# EAGLE design Wiegand_RS485 (EAGLE 7.1.0)
Assembly variants: minimal
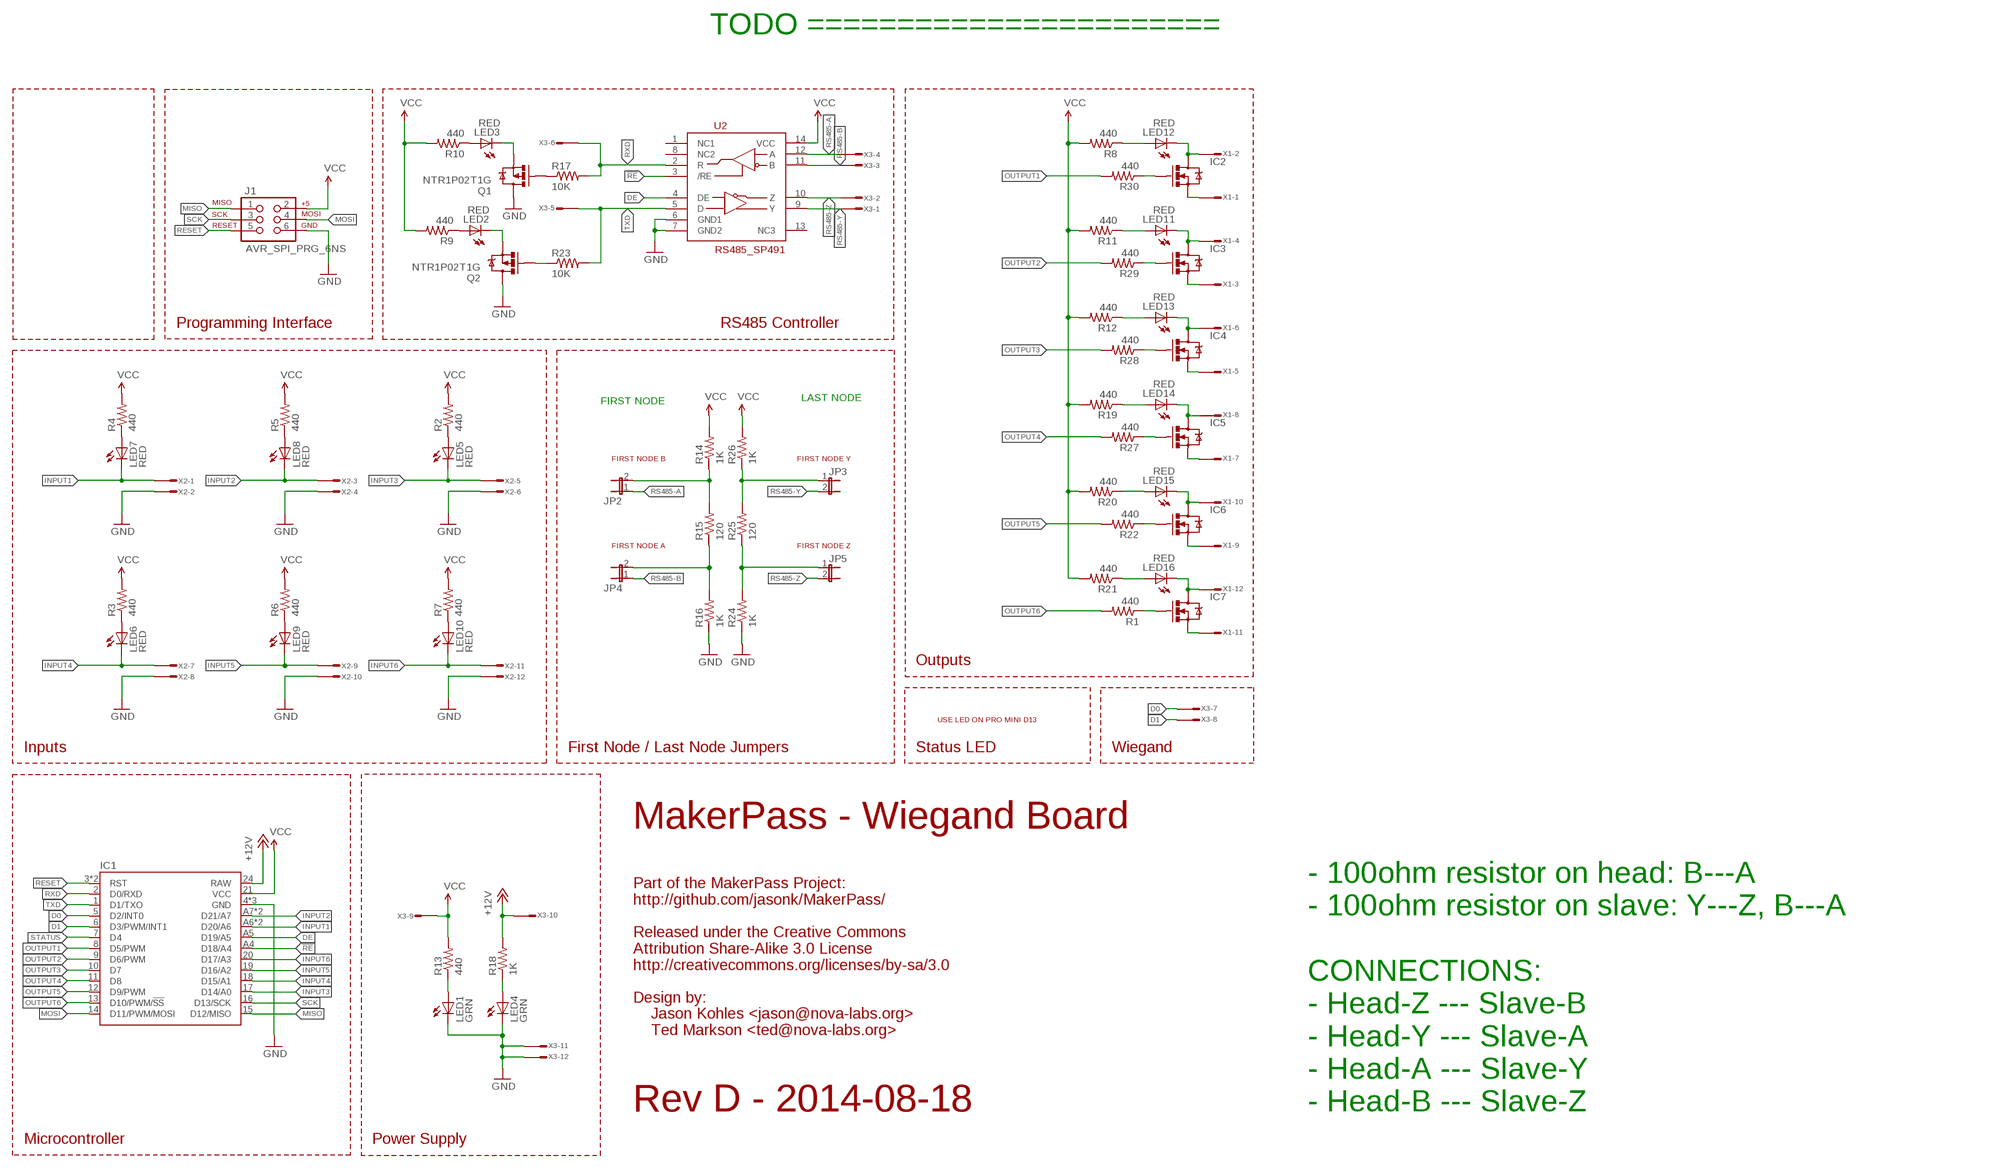
[diagram p0: schematic, sheet 1]

## Parts
IC1  ARDUINO-PRO-MINI-ALIEXPRESS  [ARDUINO-PRO-MINI-ALIEXPRESS]
IC2  MOSFET-NCHANNEL-SOT23  [SOT23]
IC3  MOSFET-NCHANNEL-SOT23  [SOT23]
IC4  MOSFET-NCHANNEL-SOT23  [SOT23]
IC5  MOSFET-NCHANNEL-SOT23  [SOT23]
IC6  MOSFET-NCHANNEL-SOT23  [SOT23]
IC7  MOSFET-NCHANNEL-SOT23  [SOT23]
J1  AVR_SPI_PRG_6NS  [2X3-NS]  (not fitted in variant minimal)
JP2  JUMPER-2PTH  [1X02]
JP3  JUMPER-2PTH  [1X02]
JP4  JUMPER-2PTH  [1X02]
JP5  JUMPER-2PTH  [1X02]
LED1  GRN  LED-0805  [LED-805]  (not fitted in variant minimal)
LED2  RED  LED-0805  [LED-805]  (not fitted in variant minimal)
LED3  RED  LED-0805  [LED-805]  (not fitted in variant minimal)
LED4  GRN  LED-0805  [LED-805]  (not fitted in variant minimal)
LED5  RED  LED-0805  [LED-805]  (not fitted in variant minimal)
LED6  RED  LED-0805  [LED-805]  (not fitted in variant minimal)
LED7  RED  LED-0805  [LED-805]  (not fitted in variant minimal)
LED8  RED  LED-0805  [LED-805]  (not fitted in variant minimal)
LED9  RED  LED-0805  [LED-805]  (not fitted in variant minimal)
LED10  RED  LED-0805  [LED-805]  (not fitted in variant minimal)
LED11  RED  LED-0805  [LED-805]  (not fitted in variant minimal)
LED12  RED  LED-0805  [LED-805]  (not fitted in variant minimal)
LED13  RED  LED-0805  [LED-805]  (not fitted in variant minimal)
LED14  RED  LED-0805  [LED-805]  (not fitted in variant minimal)
LED15  RED  LED-0805  [LED-805]  (not fitted in variant minimal)
LED16  RED  LED-0805  [LED-805]  (not fitted in variant minimal)
Q1  NTR1P02T1G  MOSFET-PCHANNELSMD  [SOT23-3]  (not fitted in variant minimal)
Q2  NTR1P02T1G  MOSFET-PCHANNELSMD  [SOT23-3]  (not fitted in variant minimal)
R1  440  RESISTOR0603-RES  [0603-RES]  (not fitted in variant minimal)
R2  440  RESISTOR0603-RES  [0603-RES]  (not fitted in variant minimal)
R3  440  RESISTOR0603-RES  [0603-RES]  (not fitted in variant minimal)
R4  440  RESISTOR0603-RES  [0603-RES]  (not fitted in variant minimal)
R5  440  RESISTOR0603-RES  [0603-RES]  (not fitted in variant minimal)
R6  440  RESISTOR0603-RES  [0603-RES]  (not fitted in variant minimal)
R7  440  RESISTOR0603-RES  [0603-RES]  (not fitted in variant minimal)
R8  440  RESISTOR0603-RES  [0603-RES]  (not fitted in variant minimal)
R9  440  RESISTOR0603-RES  [0603-RES]  (not fitted in variant minimal)
R10  440  RESISTOR0603-RES  [0603-RES]  (not fitted in variant minimal)
R11  440  RESISTOR0603-RES  [0603-RES]  (not fitted in variant minimal)
R12  440  RESISTOR0603-RES  [0603-RES]  (not fitted in variant minimal)
R13  440  RESISTOR0603-RES  [0603-RES]  (not fitted in variant minimal)
R14  1K  RESISTOR0603-RES  [0603-RES]
R15  120  RESISTOR0603-RES  [0603-RES]
R16  1K  RESISTOR0603-RES  [0603-RES]  (not fitted in variant minimal)
R17  10K  RESISTOR0603-RES  [0603-RES]
R18  1K  RESISTOR0603-RES  [0603-RES]  (not fitted in variant minimal)
R19  440  RESISTOR0603-RES  [0603-RES]
R20  440  RESISTOR0603-RES  [0603-RES]
R21  440  RESISTOR0603-RES  [0603-RES]
R22  440  RESISTOR0603-RES  [0603-RES]
R23  10K  RESISTOR0603-RES  [0603-RES]
R24  1K  RESISTOR0603-RES  [0603-RES]  (not fitted in variant minimal)
R25  120  RESISTOR0603-RES  [0603-RES]
R26  1K  RESISTOR0603-RES  [0603-RES]  (not fitted in variant minimal)
R27  440  RESISTOR0603-RES  [0603-RES]
R28  440  RESISTOR0603-RES  [0603-RES]
R29  440  RESISTOR0603-RES  [0603-RES]
R30  440  RESISTOR0603-RES  [0603-RES]
U2  RS485_SP491  [SOIC-14]
X1  CON-1X12-TERMBLOCK-3.5MM  [CON-1X12-TERMBLOCK-3.5MM]
X2  CON-1X12-TERMBLOCK-3.5MM  [CON-1X12-TERMBLOCK-3.5MM]
X3  CON-1X12-TERMBLOCK-3.5MM  [CON-1X12-TERMBLOCK-3.5MM]

## Nets
!RE!: IC1.A4(D18/A4) U2.3(/RE)
+12V [power]: IC1.24(RAW) R18.2 X3.10
D0: IC1.5(D2/INT0) X3.7
D1: IC1.6(D3/PWM/INT1) X3.8
DE: IC1.A5(D19/A5) U2.4(DE)
GND: IC1.4(GND) IC1.23(GND) IC1.25(GND) J1.6 LED1.C LED4.C Q1.3(D) Q2.3(D) R16.1 R24.1 U2.6(GND1) U2.7(GND2) X2.2 X2.4 X2.6 X2.8 X2.10 X2.12 X3.11 X3.12
INPUT1: IC1.A6(D20/A6) IC1.A6@2(D20/A6) LED7.C X2.1
INPUT2: IC1.A7(D21/A7) IC1.A7@2(D21/A7) LED8.C X2.3
INPUT3: IC1.17(D14/A0) LED5.C X2.5
INPUT4: IC1.18(D15/A1) LED6.C X2.7
INPUT5: IC1.19(D16/A2) LED9.C X2.9
INPUT6: IC1.20(D17/A3) LED10.C X2.11
MISO: IC1.15(D12/MISO) J1.1
MOSI: IC1.14(D11/PWM/MOSI) J1.4
N$1: LED1.A R13.1
N$3: IC6.2(S) X1.9
N$4: IC6.3(D) LED15.C X1.10
N$5: LED5.A R2.1
N$6: JP5.1 R24.2 R25.1
N$7: JP3.1 R25.2 R26.1
N$8: LED4.A R18.1
N$9: LED3.C Q1.2(S)
N$10: LED6.A R3.1
N$11: LED7.A R4.1
N$12: LED8.A R5.1
N$13: LED9.A R6.1
N$14: LED10.A R7.1
N$16: LED12.A R8.1
N$17: IC2.2(S) X1.1
N$18: IC2.3(D) LED12.C X1.2
N$19: IC3.2(S) X1.3
N$20: IC4.3(D) LED13.C X1.6
N$21: LED11.A R11.1
N$23: IC4.2(S) X1.5
N$25: LED13.A R12.1
N$26: LED2.A R9.1
N$27: LED3.A R10.1
N$29: IC5.2(S) X1.7
N$30: IC5.3(D) LED14.C X1.8
N$31: LED14.A R19.1
N$33: LED2.C Q2.2(S)
N$34: Q1.1(G) R17.1
N$35: LED15.A R20.1
N$37: IC7.2(S) X1.11
N$38: IC7.3(D) LED16.C X1.12
N$39: LED16.A R21.1
N$41: IC7.1(G) R1.1
N$42: Q2.1(G) R23.1
N$43: JP2.2 R14.1 R15.2
N$44: JP4.2 R15.1 R16.2
N$48: IC2.1(G) R30.1
N$49: IC3.1(G) R29.1
N$50: IC4.1(G) R28.1
N$51: IC5.1(G) R27.1
N$52: IC6.1(G) R22.1
N$53: IC3.3(D) LED11.C X1.4
OUTPUT1: IC1.8(D5/PWM) R30.2
OUTPUT2: IC1.9(D6/PWM) R29.2
OUTPUT3: IC1.10(D7) R28.2
OUTPUT4: IC1.11(D8) R27.2
OUTPUT5: IC1.12(D9/PWM) R22.2
OUTPUT6: IC1.13(D10/PWM/!SS) R1.2
RESET: IC1.3(RST) IC1.22(RST) J1.5
RS485-A: JP2.1 U2.12(A) X3.4
RS485-B: JP4.1 U2.11(B) X3.3
RS485-Y: JP3.2 U2.9(Y) X3.1
RS485-Z: JP5.2 U2.10(Z) X3.2
RXD: IC1.2(D0/RXD) R17.2 U2.2(R) X3.6
SCK: IC1.16(D13/SCK) J1.3
STATUS: IC1.7(D4)
TXD: IC1.1(D1/TXO) R23.2 U2.5(D) X3.5
VCC: IC1.21(VCC) J1.2 R2.2 R3.2 R4.2 R5.2 R6.2 R7.2 R8.2 R9.2 R10.2 R11.2 R12.2 R13.2 R14.2 R19.2 R20.2 R21.2 R26.2 U2.14(VCC) X3.9
Unconnected: U2.1(NC1) U2.8(NC2) U2.13(NC3)

## Notes on the sheet
- TODO =======================
- Programming Interface | RS485 Controller
- LAST NODE
- FIRST NODE
- FIRST NODE B | FIRST NODE Y
- FIRST NODE A | FIRST NODE Z
- Outputs
- USE LED ON PRO MINI D13
- Inputs | First Node / Last Node Jumpers | Status LED | Wiegand
- MakerPass - Wiegand Board
- Part of the MakerPass Project:
  http://github.com/jasonk/MakerPass/
  
  Released under the Creative Commons
  Attribution Share-Alike 3.0 License
  http://creativecommons.org/licenses/by-sa/3.0
  
  Design by:
      Jason Kohles <jason@nova-labs.org>
      Ted Markson <ted@nova-labs.org>
- Rev D - 2014-08-18
- - 100ohm resistor on head: B---A
  - 100ohm resistor on slave: Y---Z, B---A
  
  CONNECTIONS:
  - Head-Z --- Slave-B
  - Head-Y --- Slave-A
  - Head-A --- Slave-Y
  - Head-B --- Slave-Z
- Microcontroller | Power Supply

## Library data of the parts
IC1 = LumisenseV6:ARDUINO-PRO-MINI: ARDUINO_PRO_MINI
IC2-IC7 = LumisenseV6:MOSFET-NCHANNEL: MOSFET-NCHANNEL; MFG: DIODES INC; MFG_PN: DMN6140L-7; SUPP: DIGIKEY; SUPP_PN: DMN6140L-7DICT-ND
J1 = SparkFun-Connectors:AVR_SPI_PRG_6: AVR ISP 6 Pin This is the reduced ISP connector for AVR programming. Common on Arduino. This footprint will take up less PCB space and can be used with a 10-pin to 6-pin adapter such as SKU: BOB-08508
JP2-JP5 = SparkFun:JUMPER-2: Jumper Basic 0.1" spaced jumper. Use with breakaway headers.; MFG_PN: 1x2 pin header
LED1 LED4 = dp_devices:LED: Light Emitting Diode; MFG_PN: LG R971-KN-1
LED2 LED3 LED5-LED16 = dp_devices:LED: Light Emitting Diode; MFG_PN: LY R976-PS-36
Q1 Q2 = SparkFun:MOSFET-PCHANNEL; MFG_PN: NTR1P02T1G
R1-R13 R17 R19-R23 R27-R30 = SparkFun:RESISTOR: Resistor Basic schematic elements and footprints for 0603, 1206, and PTH resistors.; MFG_PN: ERJ3EKF3300V
R14 R16 R18 R24 R26 = SparkFun:RESISTOR: Resistor Basic schematic elements and footprints for 0603, 1206, and PTH resistors.; MFG_PN: ERJ-3EKF1001V
R15 R25 = SparkFun:RESISTOR: Resistor Basic schematic elements and footprints for 0603, 1206, and PTH resistors.; MFG_PN: ERJ-3EKF1200V
U2 = SparkFun:RS485_SP491; MFG_PN: SP491EEN-L
X1-X3 = LumisenseV6:CON-1X12: CON-1X12

## Board
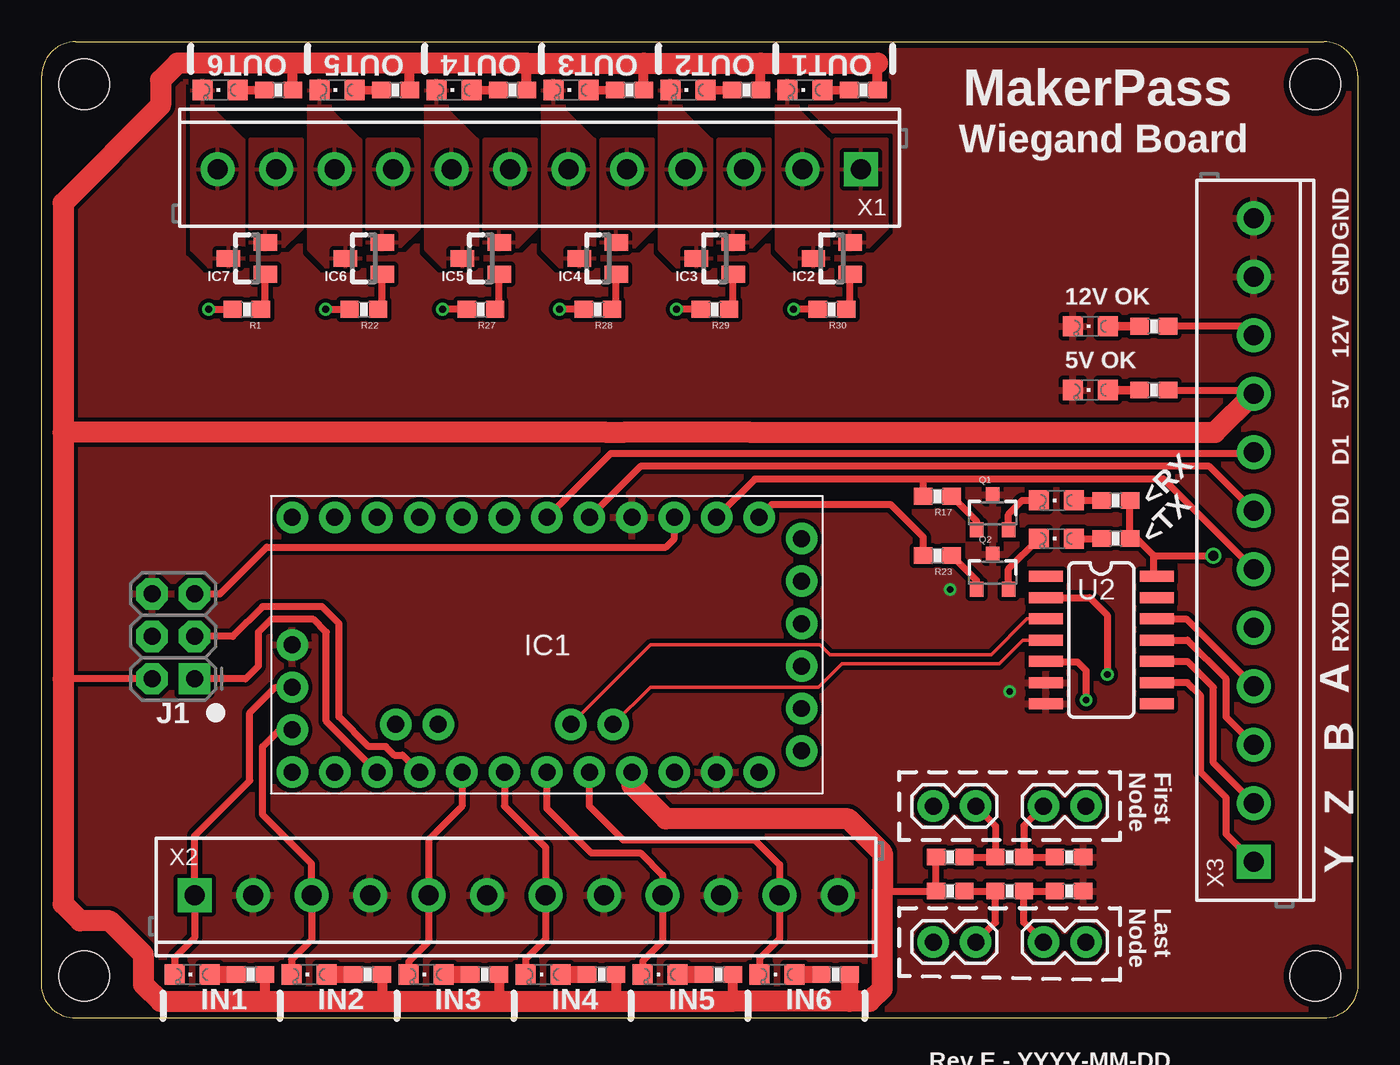
[diagram p1: board, top side]
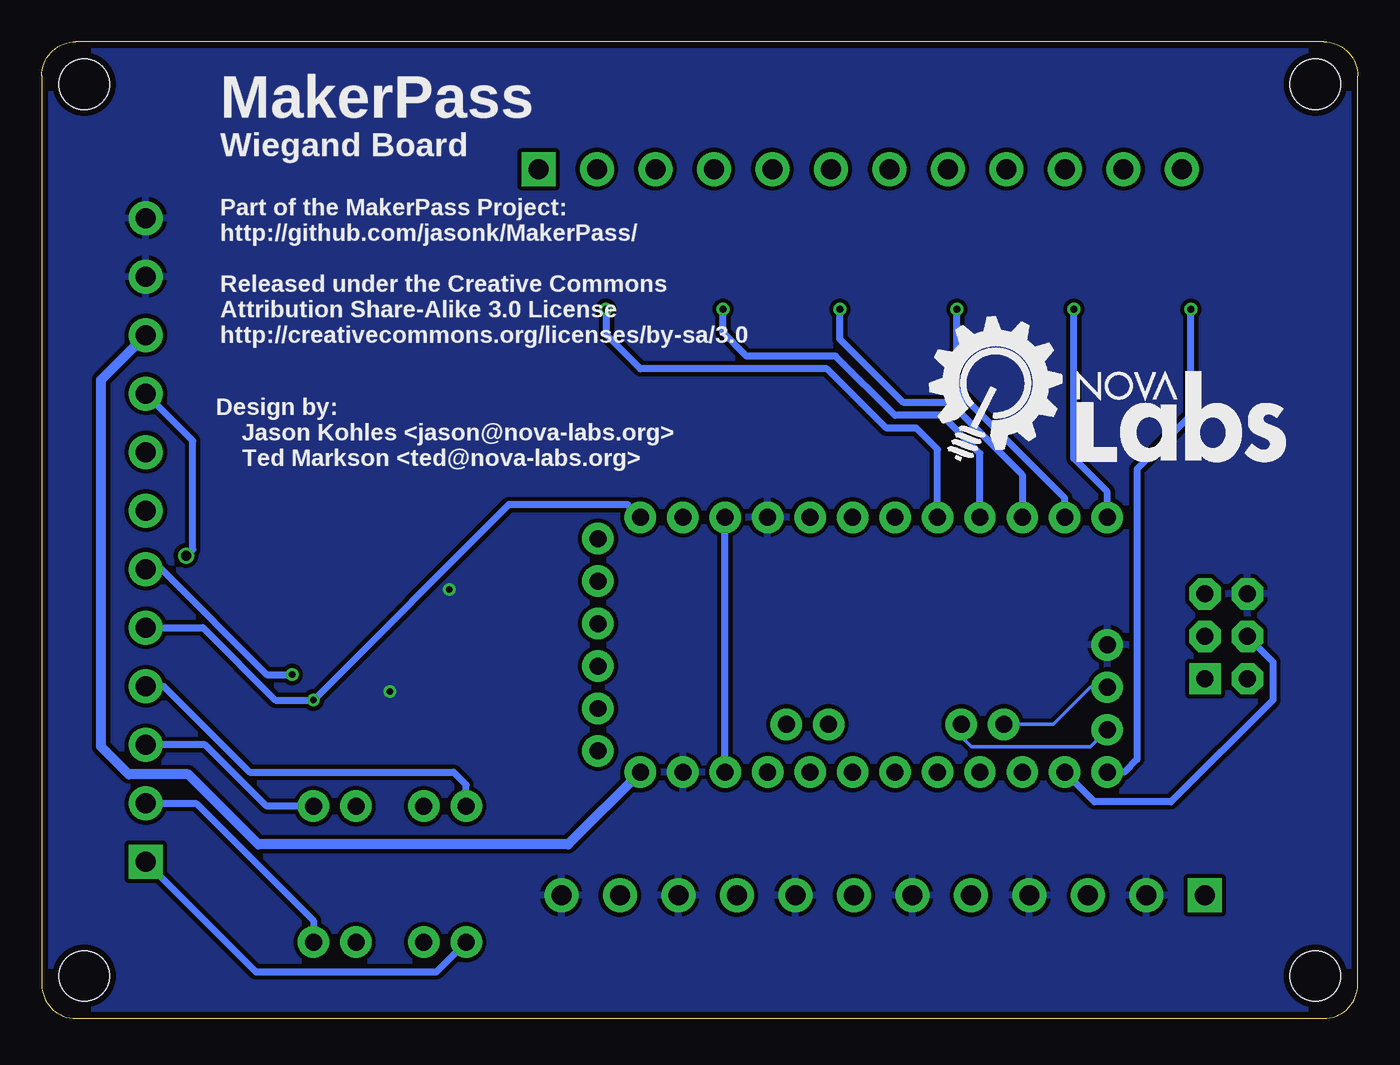
[diagram p2: board, bottom side, seen from below]

Size 78.74 x 58.42 mm. Coordinates in mm from the lower left corner, seen from the top.
Outline: 0,2.03 0,56.39 arc-90 2.03,58.42 76.71,58.42 arc-90 78.74,56.39 78.74,2.03 arc-90 76.71,0 2.03,0 arc-90 0,2.03
Copper layers (1*16): Top 0.0356mm / dielectric 1.5011mm / Bottom 0.0356mm
Design rules "OSHPark": minimum track width 6mil, minimum drill 13mil, track to track 6mil, track to pad 6mil, pad to pad 6mil, via to via 6mil, smd to smd 6mil, copper to edge 15mil, drill to drill 6mil, minimum pad ring 7mil, minimum via ring 7mil, stop-mask expansion 3mil, vias tented up to drill 0mil, thermal gap 10mil
Holes 3 mm at 2.54,2.54 76.2,2.54 2.54,55.88 76.2,55.88
tKeepout: area -0.5,-0.5 to 5.5,5.5; area 73.2,-0.5 to 79.2,5.5; area -0.5,52.9 to 5.5,58.9; area 73.2,52.9 to 79.2,58.9
bKeepout: area -0.5,-0.5 to 5.5,5.5; area 73.2,-0.5 to 79.2,5.5; area -0.5,52.9 to 5.5,58.9; area 73.2,52.9 to 79.2,58.9

### Footprints (pad centres in the part's own frame; a part is rotated, then mirrored left to right if it is on the bottom)
ARDUINO-PRO-MINI-ALIEXPRESS = drill 1.016 pad 1.88: 1 -7.62,12.7; 2 -7.62,10.16; 3 -7.62,7.62; 4 -7.62,5.08; 5 -7.62,2.54; 6 -7.62,0; 7 -7.62,-2.54; 8 -7.62,-5.08; 9 -7.62,-7.62; 10 -7.62,-10.16; 11 -7.62,-12.7; 12 -7.62,-15.24; 13 7.62,-15.24; 14 7.62,-12.7; 15 7.62,-10.16; 16 7.62,-7.62; 17 7.62,-5.08; 18 7.62,-2.54; 19 7.62,0; 20 7.62,2.54; 21 7.62,5.08; 22 7.62,7.62; 23 7.62,10.16; 24 7.62,12.7; 25 0,-15.24; A4 4.763,1.429; A5 4.763,3.969; A6 2.54,-15.24; A6@2 4.763,-9.049; A7 5.08,-15.24; A7@2 4.763,-6.509; BLK -6.35,15.24; GND -3.81,15.24; GRN 6.35,15.24; RXI 1.27,15.24; TXO 3.81,15.24; VCC -1.27,15.24
SOT23 = smd 1 x 1.4: 1 -0.95,-1.1; 2 0.95,-1.1; 3 0,1.1
2X3-NS = drill 1.016 pad 1.88 square: 1 -2.54,-1.27 | drill 1.016 pad 1.88 octagon: 2 -2.54,1.27; 3 0,-1.27; 4 0,1.27; 5 2.54,-1.27; 6 2.54,1.27
1X02 = drill 1.016 pad 1.88: 1 0,0; 2 2.54,0
LED-805 = smd 1.2 x 1.2: A 0,-1.05; C 0,1.05
SOT23-3 = smd 0.8 x 0.9: 1 -0.95,-1; 2 0.95,-1; 3 0,1.1
0603-RES = smd 1.1 x 1: 1 -0.85,0; 2 0.85,0
SOIC-14 = smd 0.66 x 2.032: 1 -4.445,-3.315; 2 -3.175,-3.315; 3 -1.905,-3.315; 4 -0.635,-3.315; 5 0.635,-3.315; 6 1.905,-3.315; 7 3.175,-3.315; 8 3.175,3.315; 9 1.905,3.315; 10 0.635,3.315; 11 -0.635,3.315; 12 -1.905,3.315; 13 -3.175,3.315; 14 -4.445,3.315
CON-1X12-TERMBLOCK-3.5MM = drill 1.2 pad 2.032 square: 1 0,0 | drill 1.2 pad 2.032: 2 3.5,0; 3 7,0; 4 10.5,0; 5 14,0; 6 17.5,0; 7 21,0; 8 24.5,0; 9 28,0; 10 31.5,0; 11 35,0; 12 38.5,0

### Placement (x,y rotation side)
IC1  30.23,22.35 270 top
IC2  47.27,45.47 90 top
IC3  40.27,45.47 90 top
IC4  33.27,45.47 90 top
IC5  26.27,45.47 90 top
IC6  19.27,45.47 90 top
IC7  12.27,45.47 90 top
J1  7.87,22.86 90 top
JP2  53.34,12.7 0 top
JP3  55.88,4.57 180 top
JP4  62.48,12.7 180 top
JP5  59.94,4.57 0 top
LED1  62.74,37.59 90 top
LED2  60.71,28.7 90 top
LED3  60.71,30.99 90 top
LED4  62.74,41.4 90 top
LED5  23,2.63 90 top
LED6  30,2.63 90 top
LED7  9,2.63 90 top
LED8  16,2.63 90 top
LED9  37,2.63 90 top
LED10  44,2.63 90 top
LED11  38.67,55.54 90 top
LED12  45.67,55.54 90 top
LED13  31.67,55.54 90 top
LED14  24.67,55.54 90 top
LED15  17.67,55.54 90 top
LED16  10.67,55.54 90 top
Q1  56.9,30.23 0 top
Q2  56.9,26.67 0 top
R1  12.27,42.42 180 top
R2  26.5,2.63 0 top
R3  33.5,2.63 0 top
R4  12.5,2.63 0 top
R5  19.5,2.63 0 top
R6  40.5,2.63 0 top
R7  47.5,2.63 0 top
R8  49.17,55.54 0 top
R9  64.26,28.7 0 top
R10  64.26,30.99 0 top
R11  42.17,55.54 0 top
R12  35.17,55.54 0 top
R13  66.55,37.59 0 top
R14  54.36,9.65 180 top
R15  57.91,9.65 180 top
R16  61.47,9.65 180 top
R17  53.59,31.24 180 top
R18  66.55,41.4 0 top
R19  28.17,55.54 0 top
R20  21.17,55.54 0 top
R21  14.17,55.54 0 top
R22  19.27,42.42 180 top
R23  53.59,27.69 180 top
R24  61.47,7.62 180 top
R25  57.91,7.62 180 top
R26  54.36,7.62 180 top
R27  26.27,42.42 180 top
R28  33.27,42.42 180 top
R29  40.27,42.42 180 top
R30  47.27,42.42 180 top
U2  63.4,22 270 top
U$1  [NOVA-LABS-LOGO-FULL-SMALL]  25.65,33.27 0 bottom
X1  49.02,50.8 180 top
X2  9.14,7.37 0 top
X3  72.51,9.37 90 top

### Tracks (layer width: path | path; a pad name or v marks a point on that pad's centre or on a via)
!RE!
  Top 0.203: U2.3 58.96,23.91 56.82,21.76 47.16,21.76 46.58,22.35 36.42,22.35 IC1.A4
+12V
  Top 0.406: X3.10 71.98,41.4 R18.2
  Bottom 0.61: IC1.24 47.24,10.41 65.79,10.41 69.98,14.61 73.53,14.61 75.18,16.26 75.18,38.2 X3.10
D0
  Top 0.406: X3.7 69.87,33.02 35.81,33.02 IC1.5
D1
  Top 0.406: X3.8 72.42,33.78 34.04,33.78 IC1.6
DE
  Top 0.203: U2.4 58.7,22.64 57.29,21.22 47.89,21.22 46.48,19.81 36.42,19.81 IC1.A5
GND  (via drill 0.41)
  other vias: 57.91,19.56 54.36,25.65
  pour Top (isolate 0.254, rank 6): 0,0 78.74,0 78.74,58.42 0,58.42
  pour Bottom (isolate 0.254): 0,0 78.74,0 78.74,58.42 0,58.42
INPUT1
  Top 0.406: IC1.A6 13.97,19.81 12.45,18.29 12.45,14.22 9.14,10.92 X2.1 9.14,4.83 7.95,3.63 LED7.C
  Bottom 0.203: IC1.A6@2 18.22,17.59 16,19.81 IC1.A6
INPUT2
  Top 0.406: IC1.A7 14.22,17.27 13.21,16.26 13.21,12.19 16.14,9.26 X2.3 16.14,4.71 14.95,3.52 LED8.C
  Bottom 0.203: IC1.A7 16,16.26 23.11,16.26 23.72,16.86 IC1.A7@2
INPUT3
  Top 0.406: IC1.17 25.15,12.7 23.14,10.7 X2.5 23.14,4.6 21.95,3.41 LED5.C
INPUT4
  Top 0.406: IC1.18 27.69,12.7 30.14,10.24 X2.7 30.14,4.74 28.95,3.55 LED6.C
INPUT5
  Top 0.406: IC1.19 30.23,12.55 32.87,9.91 35.81,9.91 37.14,8.58 X2.9 37.14,4.63 35.95,3.44 LED9.C
INPUT6
  Top 0.406: IC1.20 32.77,12.7 34.8,10.67 42.67,10.67 44.14,9.2 X2.11 44.14,4.77 42.95,3.58 LED10.C
MISO
  Top 0.406: IC1.15 17.02,17.78 17.02,23.11 16.26,23.88 13.72,23.88 12.95,23.11 12.95,21.08 12.19,20.32 J1.1
MOSI
  Bottom 0.406: J1.4 5.08,21.34 5.08,19.05 11.18,12.95 15.75,12.95 IC1.14
N$1
  Top 0.508: LED1.A R13.1
N$3
  pour Top: 19.5,52.58 22.55,52.58 22.55,47.24 21.28,45.97 19.5,45.97
N$4
  pour Top: 16,45.97 16,56.08 15.94,56.13 17.21,56.13 17.21,54.36 18.99,52.58 19.05,52.58 19.05,44.96 17.01,44.96
N$5
  Top 1.016: R2.1 LED5.A
N$6
  Top 0.406: JP5.1 58.76,5.75 R25.1 R24.2
N$7
  Top 0.406: JP3.1 57.06,5.75 R25.2 R26.1
N$8
  Top 0.508: R18.1 LED4.A
N$9
  Top 0.406: Q1.2 57.85,30.16 58.67,30.99 LED3.C
N$10
  Top 1.016: R3.1 LED6.A
N$11
  Top 1.016: R4.1 LED7.A
N$12
  Top 1.016: R5.1 LED8.A
N$13
  Top 1.016: R6.1 LED9.A
N$14
  Top 1.016: R7.1 LED10.A
N$16
  Top 0.508: LED12.A R8.1
N$17
  pour Top: 47.5,52.58 50.55,52.58 50.55,47.24 49.28,45.97 47.5,45.97
N$18
  pour Top: 44,45.97 44,56.08 43.94,56.13 45.21,56.13 45.21,54.36 46.99,52.58 47.05,52.58 47.05,44.96 45.01,44.96
N$19
  pour Top: 40.5,52.58 43.55,52.58 43.55,47.24 42.28,45.97 40.5,45.97
N$20
  pour Top: 30,45.97 30,56.08 29.94,56.13 31.21,56.13 31.21,54.36 32.99,52.58 33.05,52.58 33.05,44.96 31.01,44.96
N$21
  Top 0.508: LED11.A R11.1
N$23
  pour Top: 33.5,52.58 36.55,52.58 36.55,47.24 35.28,45.97 33.5,45.97
N$25
  Top 0.508: R12.1 LED13.A
N$26
  Top 0.406: LED2.A R9.1
N$27
  Top 0.406: LED3.A R10.1
N$29
  pour Top: 26.5,52.58 29.55,52.58 29.55,47.24 28.28,45.97 26.5,45.97
N$30
  pour Top: 23,45.97 23,56.08 22.94,56.13 24.21,56.13 24.21,54.36 25.99,52.58 26.05,52.58 26.05,44.96 24.01,44.96
N$31
  Top 0.508: LED14.A R19.1
N$33
  Top 0.406: Q2.2 57.85,26.89 LED2.C
N$34
  Top 0.406: Q1.1 55.95,29.74 R17.1
N$35
  Top 0.508: LED15.A R20.1
N$37
  pour Top: 12.5,52.58 15.55,52.58 15.55,47.24 14.28,45.97 12.5,45.97
N$38
  pour Top: 9,45.97 9,56.08 8.94,56.13 10.21,56.13 10.21,54.36 11.99,52.58 12.05,52.58 12.05,44.96 10.01,44.96
N$39
  Top 0.508: LED16.A R21.1
N$41
  Top 0.406: R1.1 13.37,42.42 IC7.1
N$42
  Top 0.406: Q2.1 55.95,26.18 R23.1
N$43
  Top 0.406: R14.1 R15.2 57.06,11.52 JP2.2
N$44
  Top 0.406: R16.2 R15.1 58.76,11.52 JP4.2
N$48
  Top 0.406: R30.1 48.37,42.42 IC2.1
N$49
  Top 0.406: R29.1 41.37,42.42 IC3.1
N$50
  Top 0.406: R28.1 34.37,42.42 IC4.1
N$51
  Top 0.406: R27.1 27.37,42.42 IC5.1
N$52
  Top 0.406: R22.1 20.37,42.42 IC6.1
N$53
  pour Top: 37,45.97 37,56.08 36.94,56.13 38.21,56.13 38.21,54.36 39.99,52.58 40.05,52.58 40.05,44.96 38.01,44.96
OUTPUT1  (via drill 0.41)
  Top 0.406: R30.2 v44.99,42.42
  Bottom 0.406: IC1.8 25.15,34.04 26.42,35.31 28.19,35.31 31.75,38.86 42.93,38.86 44.96,40.89 44.96,42.39 v44.99,42.42
OUTPUT2  (via drill 0.41)
  Top 0.406: R29.2 v37.99,42.42
  Bottom 0.406: IC1.9 22.61,33.78 24.89,36.07 27.69,36.07 31.24,39.62 36.58,39.62 37.99,41.03 v37.99,42.42
OUTPUT3  (via drill 0.41)
  Top 0.406: R28.2 v30.99,42.42
  Bottom 0.406: IC1.10 20.07,32.51 24.38,36.83 27.18,36.83 30.99,40.64 v30.99,42.42
OUTPUT4  (via drill 0.41)
  Top 0.406: R27.2 v23.99,42.42
  Bottom 0.406: IC1.11 17.53,31.13 23.99,37.59 v23.99,42.42
OUTPUT5  (via drill 0.41)
  Top 0.406: v16.99,42.42 R22.2
  Bottom 0.406: IC1.12 14.99,31.5 16.99,33.5 v16.99,42.42
OUTPUT6  (via drill 0.41)
  Top 0.406: v9.99,42.42 R1.2
  Bottom 0.406: IC1.13 13.97,14.73 13.21,15.49 13.21,32.85 9.99,36.07 v9.99,42.42
RESET
  Top 0.406: J1.5 10.67,25.4 13.46,28.19 37.34,28.19 37.85,28.7 IC1.3
  Bottom 0.406: IC1.22 IC1.3
RS485-A
  Top 0.406: U2.12 68.48,23.91 X3.4
  Bottom 0.406: JP2.1 53.34,13.97 54.1,14.73 66.29,14.73 71.43,19.87 X3.4
RS485-B
  Top 0.406: U2.11 68.55,22.64 70.87,20.32 70.87,18.02 X3.3
  Bottom 0.406: JP4.1 65.28,12.7 68.95,16.37 X3.3
RS485-Y
  Top 0.406: X3.1 70.87,11.02 70.87,13.21 69.34,14.73 69.34,19.3 68.55,20.09 U2.9
  Bottom 0.406: X3.1 65.94,2.79 55.12,2.79 JP3.2
RS485-Z
  Top 0.406: U2.10 68.55,21.36 70.1,19.81 70.1,15.28 X3.2
  Bottom 0.406: X3.2 69.51,12.87 62.48,5.84 JP5.2
RXD  (via drill 0.41)
  Top 0.406: U2.2 62.71,25.18 63.75,24.13 v63.75,20.57 | IC1.2 42.67,32.26 52.74,32.26 | X3.6 67.13,32.26 52.74,32.26 | R17.2 52.74,32.26
  Bottom 0.406: X3.6 71.58,26.87 65.28,20.57 v63.75,20.57
SCK
  Top 0.406: IC1.16 21.59,15.75 21.08,15.75 20.57,16.26 19.56,16.26 17.78,18.03 17.78,23.62 16.76,24.64 13.21,24.64 11.43,22.86 J1.3
TXD  (via drill 0.41)
  Top 0.406: 59.44,21.34 60.06,21.34 | 60.06,21.34 U2.5 | 60.06,21.34 61.98,21.34 62.48,20.83 v62.48,19.05 | R23.2 52.74,28.79 50.8,30.73 43.69,30.73 IC1.1
  Bottom 0.406: IC1.1 43.69,30.73 50.8,30.73 v62.48,19.05 64.77,19.05 69.09,23.37 X3.5
VCC  (via drill 0.61)
  Top 0.406: 33.48,34.75 33.78,35.05 | 35.05,34.8 34.8,35.05 | 42.67,34.8 42.42,35.05 | U2.14 66.69,26.42 66.55,26.55 66.55,27.69 | 66.55,27.69 v70.1,27.69 | 50.29,7.62 R26.2 R14.2 | J1.2 1.27,20.32 | R10.2 R9.2 65.53,28.7 66.55,27.69 | R13.2 72.29,37.59 X3.9
  Top 0.61: 41.35,1.02 R6.2 | R3.2 34.35,1.02 | R2.2 27.35,1.02 | R5.2 20.35,1.02 | R4.2 13.35,1.02 | R21.2 15.02,57.15 | R12.2 36.02,57.15 | R11.2 43.02,57.15 | R8.2 50.02,57.15 | R20.2 22.02,57.15 | R19.2 29.02,57.15
  Top 1.016: 48.35,1.02 R7.2
  Top 1.27: 1.27,35.05 33.78,35.05 34.8,35.05 42.42,35.05 70.19,35.05 X3.9 | 1.27,35.05 1.27,20.32 1.27,6.86 2.29,5.84 4.06,5.84 6.1,3.81 6.1,2.03 7.11,1.02 13.35,1.02 20.35,1.02 27.35,1.02 34.35,1.02 41.35,1.02 48.35,1.02 49.53,1.02 50.29,1.78 50.29,7.62 50.29,9.91 48.26,11.94 37.34,11.94 35.31,13.97 IC1.21 | 50.02,57.15 43.02,57.15 36.02,57.15 29.02,57.15 22.02,57.15 15.02,57.15 8.13,57.15 7.11,56.13 7.11,54.61 1.27,48.77 1.27,35.05
  Bottom 0.406: X3.9 69.7,34.56 69.7,28.04 v70.1,27.69

### Text on the board
bPlace: Wiegand Board
tNames: OUT6 | OUT5 | OUT4 | OUT3 | OUT2 | OUT1 | MakerPass | Wiegand Board | GND | 12V OK | GND | 5V OK | 12V | 5V | D1 | <RX | D0 | <TX | TXD | RXD | A | B | First / Node | Z | Y | Last / Node | IN1 | IN2 | IN3 | IN4 | IN5 | IN6 | Rev E - YYYY-MM-DD
bNames: MakerPass | Part of the MakerPass Project: / http://github.com/jasonk/MakerPass/ / / Released under the Creative Commons / Attribution Share-Alike 3.0 License / http://creativecommons.org/licenses/by-sa/3.0 | Design by: / Jason Kohles <jason@nova-labs.org> / Ted Markson <ted@nova-labs.org>